# EAGLE design 12V Battery Support Circuit (EAGLE 5.12)
PARTNO: 3362P-1-103LF
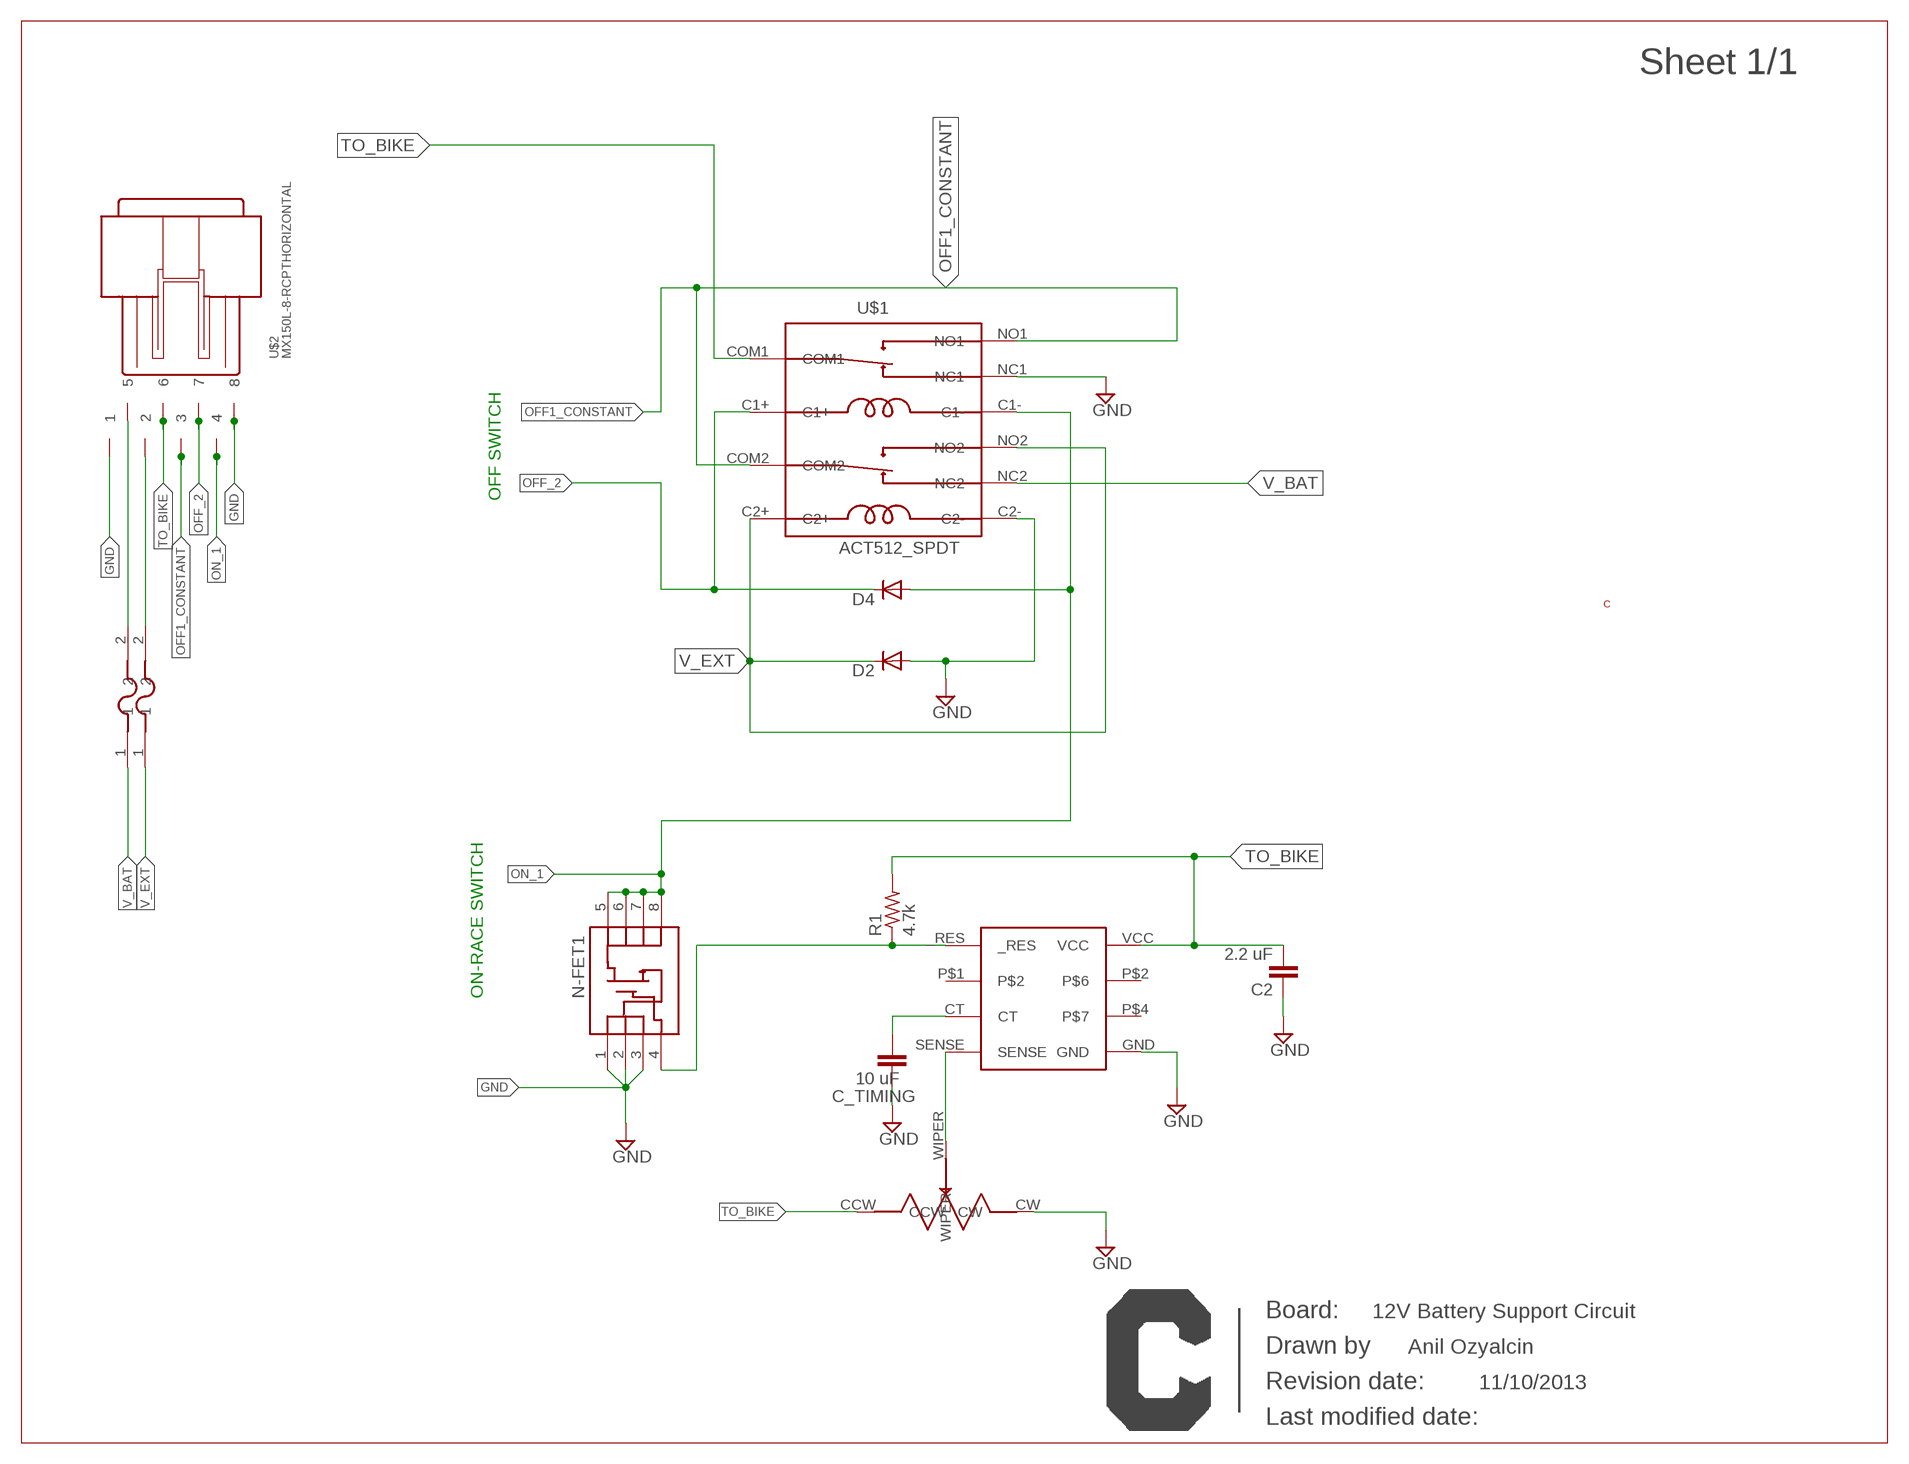
[diagram p0: schematic, sheet 1]

## Parts
C2  2.2 uF  C-EUC0603  [C0603]
C_TIMING  10 uF  C-EUC1206  [C1206]
D2  DIODE-SOD123  [SOD123]
D4  DIODE-SOD123  [SOD123]
N-FET1  MOSFET-NCHANNEL-SOIC8  [SO08]
R1  4.7k  R-US_R0603  [R0603]
U$1  ACT512_SPDT  [SPDT_DUAL]
U$2  MX150L-8-RCPTHORIZONTAL  [MOLEX-8-DUAL-HORIZONTAL]
U$3  3362P-103LF-ND  [3362P-103LF-ND_THROUGH_HOLE]
U$4  TL7700  [SSOP]
U$5  CURRENT-C-LETTER-LANDSCAPE  [BLANK]
U$7  LITTELFUSE_01530008Z_VERT  [LITTELFUSE_01530008Z]
U$8  LITTELFUSE_01530008Z_VERT  [LITTELFUSE_01530008Z]
U$9  CURRENT-LOGO-0.25"  [CURRENT-0.25"]

## Nets
GND: C2.1 C_TIMING.1 D2.A N-FET1.1(S) N-FET1.2(S) N-FET1.3(S) U$1.C2- U$1.NC1 U$2.P$1 U$2.P$8 U$3.CW U$4.GND
N$3: N-FET1.4(G) R1.1 U$4._RES
N$8: C_TIMING.2 U$4.CT
OFF1_CONSTANT: U$1.COM2 U$1.NO1 U$2.P$6
OFF_2: D4.C U$1.C1+ U$2.P$2
ON_1: D4.A N-FET1.5(D) N-FET1.6(D) N-FET1.7(D) N-FET1.8(D) U$1.C1- U$2.P$5
TO_BIKE: C2.2 R1.2 U$1.COM1 U$2.P$3 U$3.CCW U$4.VCC
V_2: U$2.P$4 U$7.2
V_3: U$2.P$7 U$8.2
V_BAT: U$1.NC2 U$7.1
V_EXT: D2.C U$1.C2+ U$1.NO2 U$8.1
V_SENSE: U$3.WIPER U$4.SENSE
Unconnected: U$4.P$1 U$4.P$2 U$4.P$4

## Notes on the sheet
- OFF SWITCH
- ON-RACE SWITCH
- 12V Battery Support Circuit
- Anil Ozyalcin
- 11/10/2013

## Library data of the parts
C2 C_TIMING = resistor:C-EU: CAPACITOR, European symbol
D2 D4 = diode:DIODE-: DIODE
N-FET1 = SparkFun:MOSFET-NCHANNEL-SOIC8: N-Channel MOSFET IRF9410 and NDS8434 are common, SOIC-8 parts.
R1 = rcl:R-US_: RESISTOR, American symbol
U$1 = Philips_Relay:ACT512_SPDT
U$2 = Molex-Aaron_2:MX150L-8-RCPT
U$3 = Bourns:3362P-103LF-ND: 10 K Trimpot, 1 Turn
U$4 = voltage_supervisor:TL7700
U$5 = Frames:CURRENT-C-LETTER-LANDSCAPE
U$7 U$8 = fuse:LITTELFUSE_01530008Z_VERT
U$9 = Logos:CURRENT-LOGO

## Board
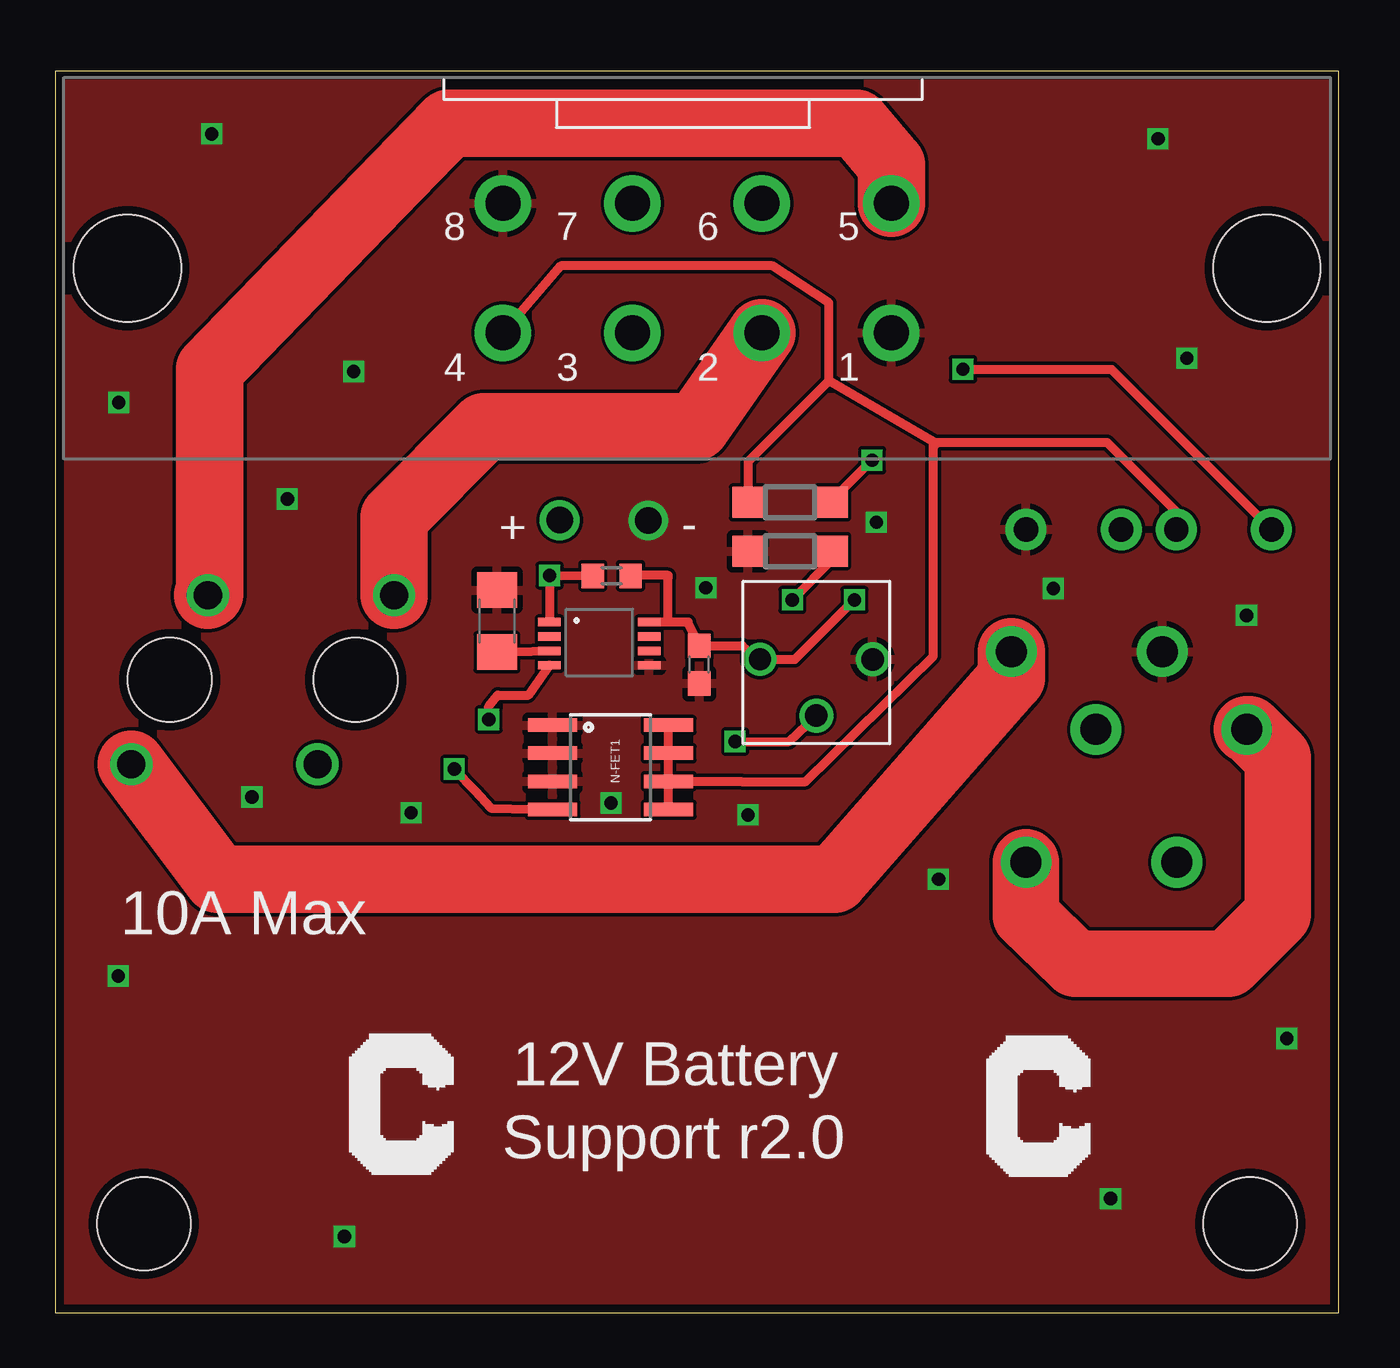
[diagram p1: board, top side]
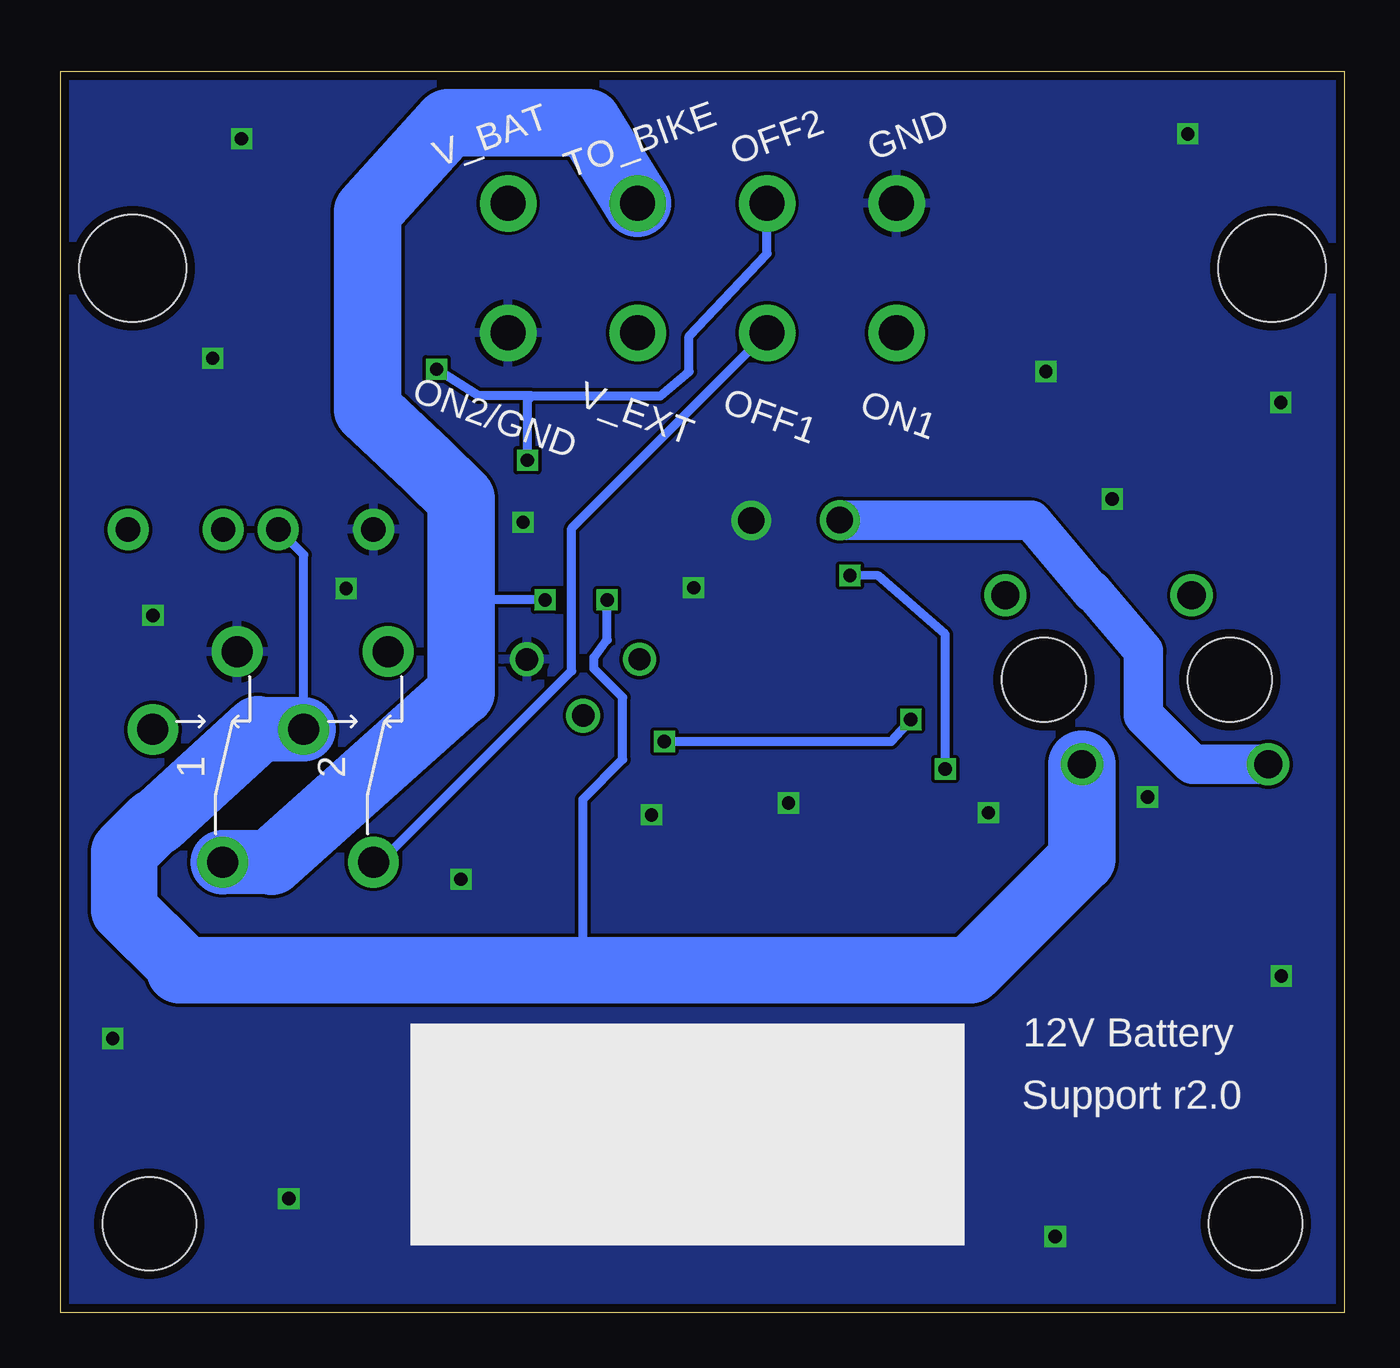
[diagram p2: board, bottom side, seen from below]

Size 57.91 x 56 mm. Coordinates in mm from the lower left corner, seen from the top.
Outline: 0,0 57.91,0 57.91,56 0,56 0,0
Copper layers (1*16): Top 0.0356mm / dielectric 1.5011mm / Bottom 0.0356mm
Design rules "OSH Park 2-layer": minimum track width 6mil, minimum drill 13mil, track to track 6mil, track to pad 6mil, pad to pad 6mil, via to via 6mil, smd to smd 6mil, copper to edge 15mil, drill to drill 6mil, minimum pad ring 7mil, minimum via ring 7mil, stop-mask expansion 4mil, vias tented up to drill 0mil, thermal gap 10mil
Holes 4.2 mm at 53.91,4.01 3.99,4.01

### Footprints (pad centres in the part's own frame; a part is rotated, then mirrored left to right if it is on the bottom)
C0603 = smd 1.1 x 1: 1 -0.85,0; 2 0.85,0
C1206 = smd 1.6 x 1.8: 1 -1.4,0; 2 1.4,0
SOD123 = smd 1.4 x 1.4: A 1.9,0; C -1.9,0
SO08 = smd 0.61 x 2.21: 1 -1.905,-2.616; 2 -0.635,-2.616; 3 0.635,-2.616; 4 1.905,-2.616; 5 1.905,2.616; 6 0.635,2.616; 7 -0.635,2.616; 8 -1.905,2.616
R0603 = smd 1 x 1.1: 1 -0.85,0; 2 0.85,0
SPDT_DUAL = drill 1.092 pad 1.854 round: C1+ 15.011,11.074; C1- 15.011,6.782; C2+ 15.011,4.293; C2- 15.011,0 | drill 1.397 pad 2.286 round: COM1 0,6.807; COM2 0,0; NC1 9.5,6.147; NC2 9.5,-0.66; NO1 5.994,9.957; NO2 5.994,3.15
MOLEX-8-DUAL-HORIZONTAL = drill 1.575 pad 2.54 round: P$1 -8.763,2.921; P$2 -2.921,2.921; P$3 2.921,2.921; P$4 8.763,2.921; P$5 -8.763,-2.921; P$6 -2.921,-2.921; P$7 2.921,-2.921; P$8 8.763,-2.921 | hole 4.826: -25.705,0; 25.705,0
3362P-103LF-ND_THROUGH_HOLE = drill 1 round: CCW -2.54,2.54 | drill 1.016 round: CW 2.54,2.54; WIPER 0,0
SSOP = smd 1.016 x 0.38: _RES -2.25,0.919; CT -2.25,-0.381; GND 2.25,-1.031; P$1 2.25,-0.381; P$2 -2.25,0.269; P$4 2.25,0.269; SENSE -2.25,-1.031; VCC 2.25,0.919
LITTELFUSE_01530008Z = drill 1.27 round: 1 1.727,3.81; 2 -1.727,-3.81 | hole 3.785: 0,0

### Placement (x,y rotation side)
C2  29.06,29.23 90 top
C_TIMING  19.93,31.19 270 top
D2  33.15,34.35 180 top
D4  33.15,36.55 180 top
N-FET1  25.05,24.6 270 top
R1  25.1,33.23 0 top
U$1  43.8,20.31 90 bottom
U$2  28.96,47.11 0 top
U$3  34.34,26.93 0 top
U$4  24.55,30.23 0 top
U$5  -16.52,57.16 0 top  (outside the outline)
U$6  CURRENT-LOGO-0.25"  [CURRENT-0.25"]  42.07,6.19 0 top
U$7  5.15,28.55 180 top
U$8  13.55,28.55 180 top
U$9  13.32,6.28 0 top

### Tracks (layer width: path | path; a pad name or v marks a point on that pad's centre or on a via)
GND  (via drill 0.6, 1.2)
  other vias: 13.45,42.45 49.75,52.95 51.05,43.05 53.75,31.45 39.85,19.55 2.83,15.18 47.61,5.14 2.85,41.05 31.25,22.45 16.05,22.55 26.75,35.73 45.03,32.66 7.05,53.17 13.04,3.43 55.56,12.36 8.86,23.26 10.46,36.7 25.07,22.99 29.35,32.7 37.05,35.65
  pour Top: -3.31,57.87 60.71,58.03 60.71,-4.39 -3.31,-4.55
  pour Bottom: -4.14,59.05 63.35,59.05 63.44,-6.22 -4.05,-6.22
N$3  (via drill 0.6)
  Top 0.406: U$4._RES v22.3,33.25 R1.1 | N-FET1.4 19.65,22.75 18.95,23.52 v18,24.52
  Bottom 0.406: v22.3,33.25 21,33.23 18,30.6 v18,24.52
N$8
  Top 0.406: C_TIMING.2 U$4.CT
OFF1_CONSTANT
  Top 3: U$1.NO1 53.87,26.31 55.15,25.02 55.15,17.96 52.92,15.73 46.03,15.73 43.8,17.9 43.8,20.25 U$1.COM2
  Bottom 0.406: U$1.COM2 43.49,20.31 34.85,28.95 34.85,35.37 U$2.P$6
OFF_2  (via drill 0.6)
  Top 0.406: v40.95,42.55 47.65,42.55 U$1.C1+ | D4.C 35.05,36.65 v36.85,38.45
  Bottom 0.406: U$2.P$2 26.04,47.77 29.55,44.05 29.55,42.45 30.85,41.35 36.65,41.35 | 36.65,41.35 39.05,41.35 v40.95,42.55 | v36.85,38.45 36.85,41.15 36.65,41.35
ON_1
  Top 0.406: N-FET1.5 N-FET1.6 | N-FET1.6 N-FET1.7 N-FET1.8 | 34.91,42.03 39.62,39.29 39.62,39.05 | 34.91,42.03 34.91,45.54 32.37,47.21 22.81,47.21 U$2.P$5 | 39.62,39.05 39.62,29.61 33.85,23.95 30.95,23.95 30.94,23.96 N-FET1.6 | U$1.C1- 50.58,36.12 47.45,39.25 39.82,39.25 39.62,39.05 | D4.A 31.25,38.38 34.91,42.03
TO_BIKE  (via drill 0.6)
  Top 0.406: 27.65,31.15 U$4.VCC | 27.65,31.15 28.55,31.15 C2.2 30.98,30.08 U$3.CCW 33.37,29.47 v36.05,32.15 | 27.65,33.25 27.65,33.15 | 27.65,31.15 27.65,33.25 | R1.2 25.97,33.25 27.65,33.25
  Bottom 0.406: v36.05,32.15 39.85,32.15
  Bottom 2.9: 48.4,20.34 U$1.COM1
  Bottom 3: 39.85,27.99 48.4,20.34
  Bottom 3.048: U$2.P$3 34.13,53.66 40.44,53.66 44.05,49.65 44.05,40.75 41.39,38.23 39.85,36.7 39.85,32.15 39.85,27.99
V_2
  Top 3.048: U$2.P$4 37.72,51.78 36.15,53.65 17.75,53.65 6.95,42.55 6.95,32.43 U$7.2
V_3
  Top 3.048: U$2.P$7 28.96,40 28.91,39.95 19.35,39.95 15.28,35.88 U$8.2
V_BAT  (via drill 1.2)
  Top 3.048: U$1.NC2 43.14,28.64 35.15,19.55 7.32,19.55 U$7.1
  Bottom 1.778: U$7.1 6.84,24.74 9.05,26.95 9.05,29.85 11.37,32.59 11.36,32.47 14.11,35.74 v22.75,35.75
V_EXT  (via drill 0.6)
  Top 0.406: D2.C 35.05,33.95 v33.25,32.15
  Bottom 0.406: U$1.NO2 46.95,34.18 U$1.C2+ | U$8.1 11.84,24.75 | v33.25,32.15 33.25,30.35 33.85,29.55 33.85,29.05 32.55,27.75 32.55,24.95 34.35,23.15 34.35,15.45 34.43,15.45
  Bottom 2.9: 49,26.31 U$1.NO2
  Bottom 3: 49,26.31 53.59,22.11 53.7,22.11 55.04,20.77 55.04,18.17 52.55,15.68 52.55,15.45 34.43,15.45 16.85,15.45 11.83,20.48
  Bottom 3.048: 11.83,20.48 U$8.1
V_SENSE  (via drill 0.6)
  Top 0.406: v19.55,26.75 19.55,27.35 19.95,27.85 21.34,27.85 U$4.SENSE | v30.67,25.76 33.11,25.76 U$3.WIPER
  Bottom 0.406: v30.67,25.76 30.65,25.76 29.55,25.75 20.44,25.76 v19.55,26.75

### Text on the board
tPlace: + | - | 10A Max | 12V Battery | Support r2.0
bPlace: GND | OFF2 | V_BAT | TO_BIKE | ON1 | OFF1 | V_EXT | ON2/GND | 12V Battery | Support r2.0